# EAGLE design Autopilot (EAGLE 9.6.2)
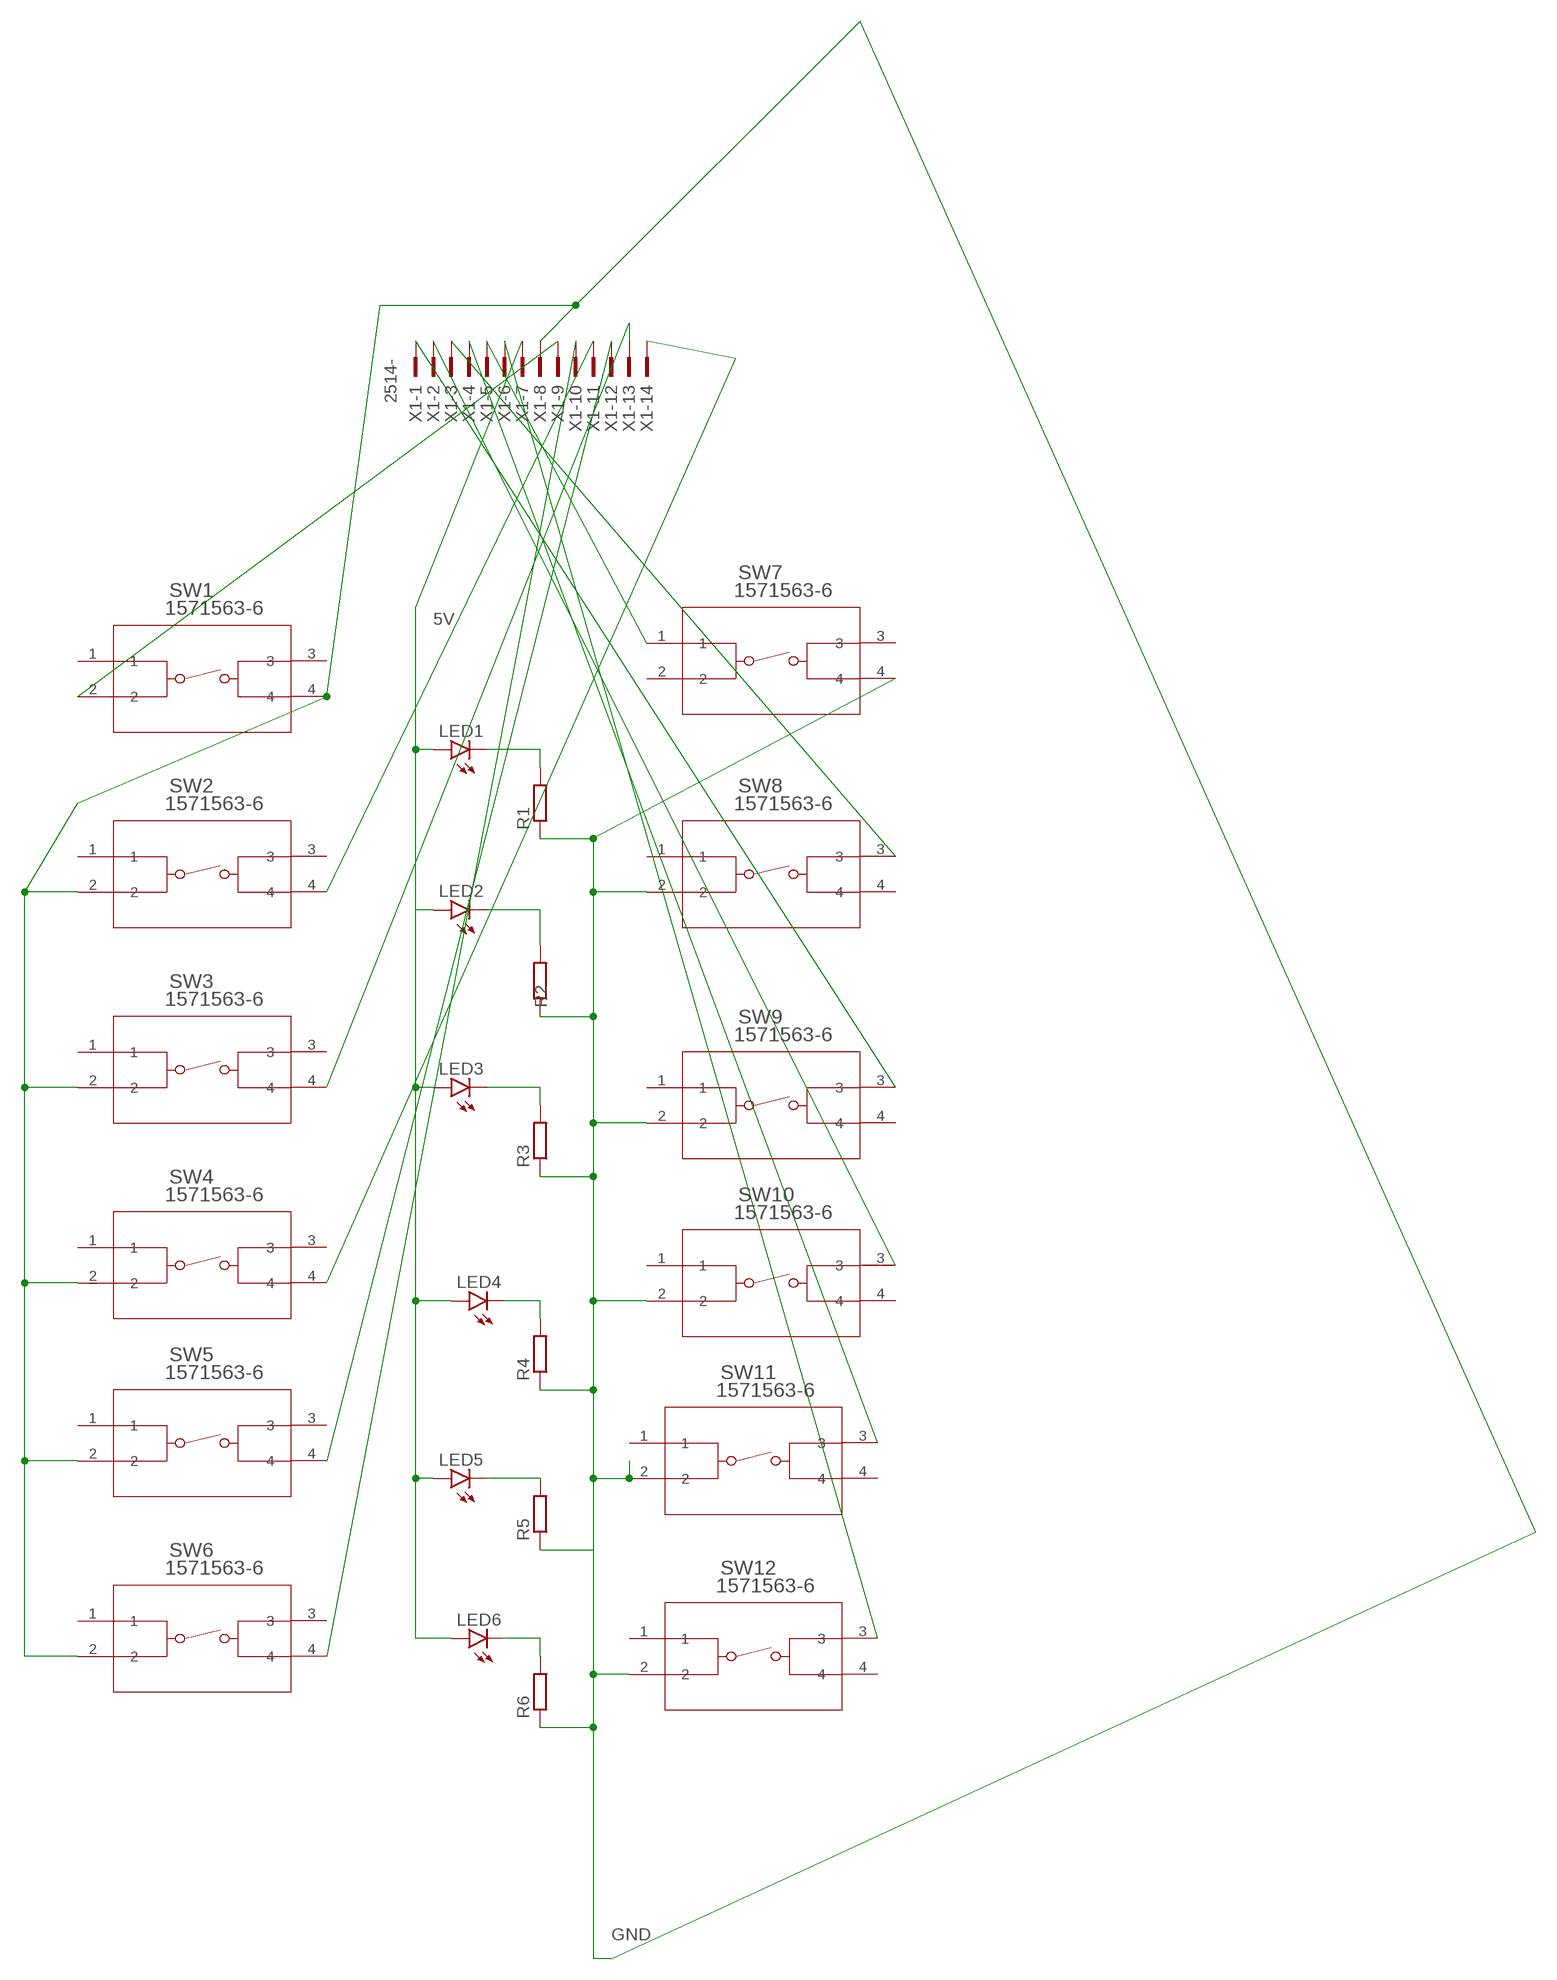
[diagram p0: schematic, sheet 1]

## Parts
LED1  LEDCHIPLED_1206  [CHIPLED_1206]
LED2  LEDCHIPLED_1206  [CHIPLED_1206]
LED3  LEDCHIPLED_1206  [CHIPLED_1206]
LED4  LEDCHIPLED_1206  [CHIPLED_1206]
LED5  LEDCHIPLED_1206  [CHIPLED_1206]
LED6  LEDCHIPLED_1206  [CHIPLED_1206]
R1  R-EU_R1206  [R1206]
R2  R-EU_R1206  [R1206]
R3  R-EU_R1206  [R1206]
R4  R-EU_R1206  [R1206]
R5  R-EU_R1206  [R1206]
R6  R-EU_R1206  [R1206]
SW1  1571563-6  [SW4_1437565-E]
SW2  1571563-6  [SW4_1437565-E]
SW3  1571563-6  [SW4_1437565-E]
SW4  1571563-6  [SW4_1437565-E]
SW5  1571563-6  [SW4_1437565-E]
SW6  1571563-6  [SW4_1437565-E]
SW7  1571563-6  [SW4_1437565-E]
SW8  1571563-6  [SW4_1437565-E]
SW9  1571563-6  [SW4_1437565-E]
SW10  1571563-6  [SW4_1437565-E]
SW11  1571563-6  [SW4_1437565-E]
SW12  1571563-6  [SW4_1437565-E]
X1  2514-  [PAK100/2500-14]

## Nets
5V: LED1.A LED2.A LED3.A LED4.A LED5.A LED6.A X1.7
GND: R1.1 R2.1 R3.1 R4.1 R5.1 R6.1 SW1.4 SW2.2 SW3.2 SW4.2 SW5.2 SW6.2 SW7.4 SW8.2 SW9.2 SW10.2 SW11.2 SW12.2 X1.8
N$1: LED1.C R1.2
N$2: LED2.C R2.2
N$3: LED3.C R3.2
N$4: LED4.C R4.2
N$5: LED5.C R5.2
N$6: LED6.C R6.2
N$7: SW1.2 X1.9
N$8: SW7.1 X1.5
N$9: SW8.3 X1.3
N$10: SW9.3 X1.1
N$11: SW10.3 X1.2
N$12: SW11.3 X1.4
N$13: SW12.3 X1.6
N$14: SW2.4 X1.11
N$15: SW4.4 X1.14
N$16: SW3.4 X1.13
N$17: SW5.4 X1.12
N$18: SW6.4 X1.10
Unconnected: SW1.1 SW1.3 SW2.1 SW2.3 SW3.1 SW3.3 SW4.1 SW4.3 SW5.1 SW5.3 SW6.1 SW6.3 SW7.2 SW7.3 SW8.1 SW8.4 SW9.1 SW9.4 SW10.1 SW10.4 SW11.1 SW11.4 SW12.1 SW12.4

## Library data of the parts
LED1-LED6 = led:LED: LED OSRAM: - CHIPLED LG R971, LG N971, LY N971, LG Q971, LY Q971, LO R971, LY R971 LH N974, LH R974 LS Q976, LO Q976, LY Q976 LO Q996 - Hyper CHIPLED LW Q18S LB Q993, LB Q99A, LB R99A - SideLED LS A670, LO A670, LY A670, LG A670, LP A670 LB A673, LV A673, LT A673, LW A673 LH A674 LY A675 LS A676, LA A676, LO A676, LY A676, LW A676 LS A679, LY A679, LG A679 - Hyper Micro SIDELED® LS Y876, LA Y876, LO Y876, LY Y876 LT Y87S - SmartLED LW L88C, LW L88S LB L89C, LB L89S, LG L890 LS L89K, LO L89K, LY L89K LS L896, LA L896, LO L896, LY L896 - TOPLED LS T670, LO T670, LY T670, LG T670, LP T670 LSG T670, LSP T670, LSY T670, LOP T670, LYG T670 LG T671, LOG T671, LSG T671 LB T673, LV T673, LT T673, LW T673 LH T674 LS T676, LA T676, LO T676, LY T676, LB T676, LH T676, LSB T676, LW T676 LB T67C, LV T67C, LT T67C, LS T67K, LO T67K, LY T67K, LW E67C LS E67B, LA E67B, LO E67B, LY E67B, LB E67C, LV E67C, LT E67C LW T67C LS T679, LY T679, LG T679 LS T770, LO T770, LY T770, LG T770, LP T770 LB T773, LV T773, LT T773, LW T773 LH T774 LS E675, LA E675, LY E675, LS T675 LS T776, LA T776, LO T776, LY T776, LB T776 LHGB T686 LT T68C, LB T68C - Hyper Mini TOPLED® LB M676 - Mini TOPLED Santana® LG M470 LS M47K, LO M47K, LY M47K Source: http://www.osram.convergy.de LUXEON: - LUMILED® LXK2-PW12-R00, LXK2-PW12-S00, LXK2-PW14-U00, LXK2-PW14-V00 LXK2-PM12-R00, LXK2-PM12-S00, LXK2-PM14-U00 LXK2-PE12-Q00, LXK2-PE12-R00, LXK2-PE12-S00, LXK2-PE14-T00, LXK2-PE14-U00 LXK2-PB12-K00, LXK2-PB12-L00, LXK2-PB12-M00, LXK2-PB14-N00, LXK2-PB14-P00, LXK2-PB14-Q00 LXK2-PR12-L00, LXK2-PR12-M00, LXK2-PR14-Q00, LXK2-PR14-R00 LXK2-PD12-Q00, LXK2-PD12-R00, LXK2-PD12-S00 LXK2-PH12-R00, LXK2-PH12-S00 LXK2-PL12-P00, LXK2-PL12-Q00, LXK2-PL12-R00 Source: www.luxeon.com KINGBRIGHT: KA-3528ASYC Source: www.kingbright.com
R1-R6 = rcl:R-EU_: RESISTOR, European symbol; SPICEPREFIX: R
SW1-SW12 = Switches:1571563-6; BUILT_BY: EMA_UL_Team; CATEGORY: Tactile Switches; COPYRIGHT: Copyright (C) 2016 Accelerated Designs. All rights reserved; DESCRIPTION: FSM14JSMAATR=TACT,SMT,T&R; MANUFACTURER_PART_NUMBER: 1571563-6; PART_STATUS: active; SERIES: Alcoswitch FSMJSMA; VENDOR: TE Connectivity
X1 = con-3m:2514-: 3M (TM) Pak 100 4-Wall Header Source: 3M; OC_FARNELL: unknown; OC_NEWARK: unknown

## Board
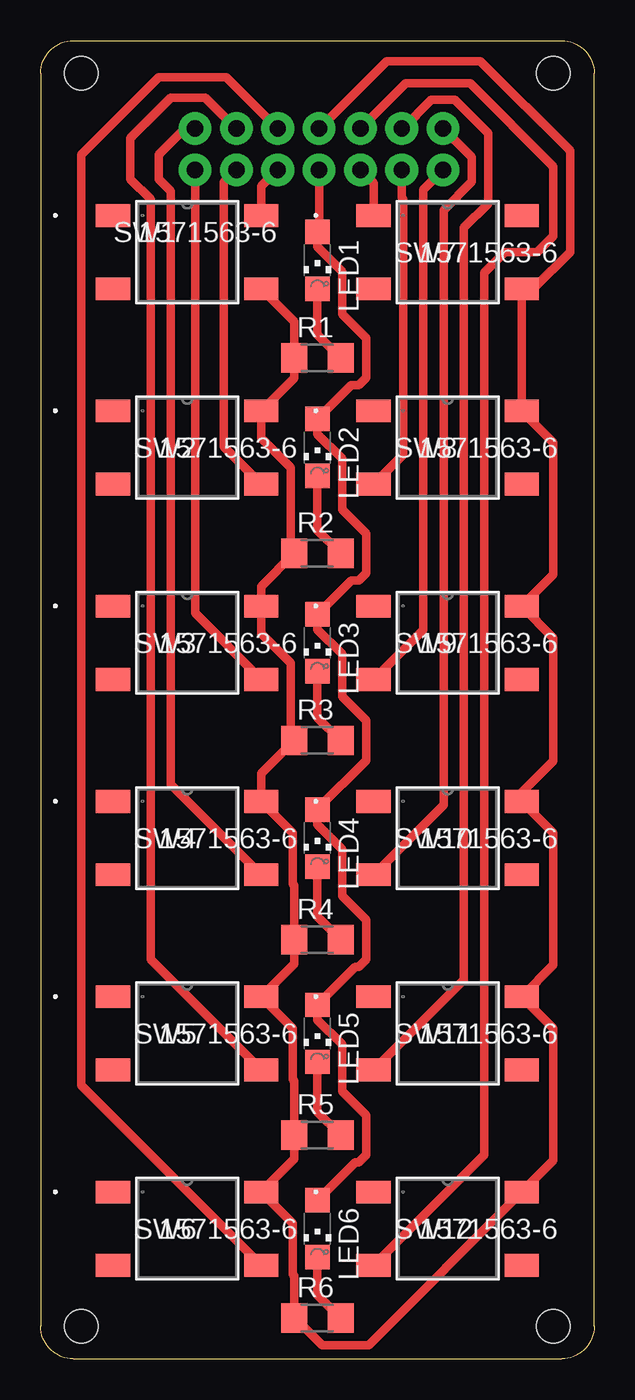
[diagram p1: board, top side]
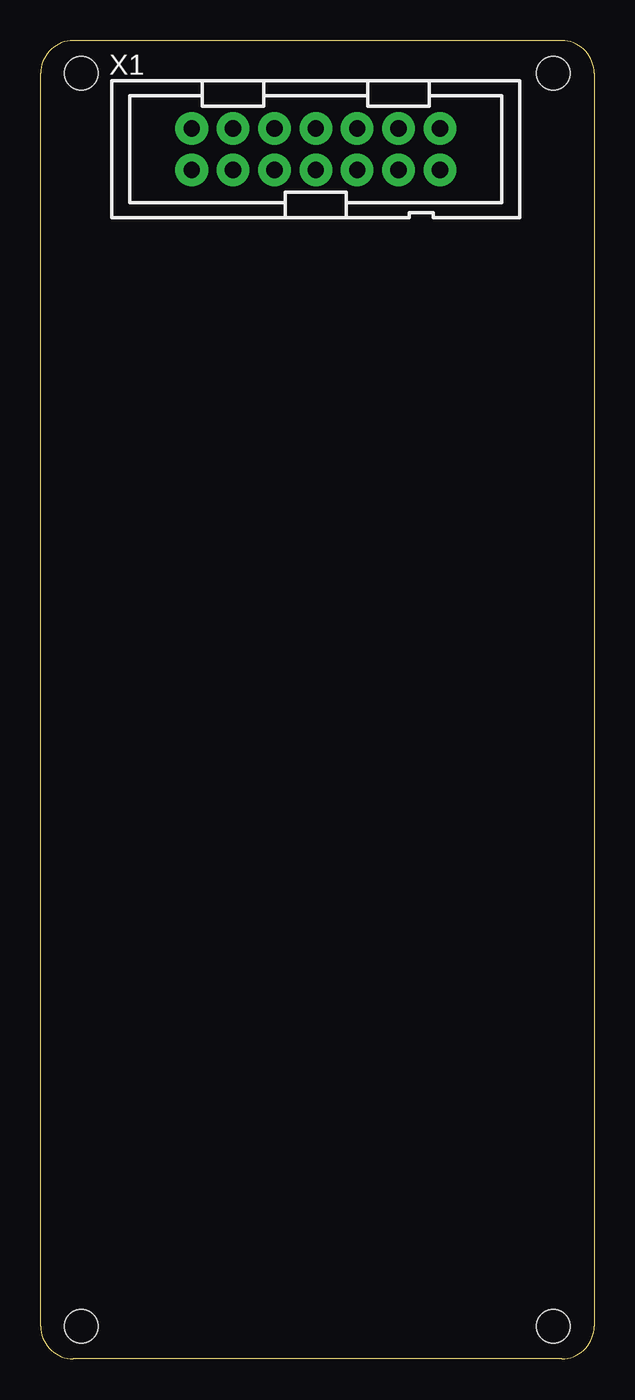
[diagram p2: board, bottom side, seen from below]

Size 34 x 81 mm. Coordinates in mm from the lower left corner, seen from the top.
Outline: 2,0 32,0 arc90 34,2 34,79 arc90 32,81 2,81 arc90 0,79 0,2 arc90 2,0
Copper layers (1*16): Top 0.035mm / dielectric 1.5mm / Bottom 0.035mm
Design rules "swidzi_milling_3018_tht_test": minimum track width 20mil, minimum drill 0.8mm, track to track 20mil, track to pad 20mil, pad to pad 20mil, via to via 6mil, smd to smd 6mil, copper to edge 15mil, drill to drill 6mil, minimum pad ring 10mil, minimum via ring 8mil, stop-mask expansion 4mil, vias tented up to drill 0mil, thermal gap 10mil
Holes 2.05 mm at 2.5,2 31.5,2 2.5,79 31.5,79

### Footprints (pad centres in the part's own frame; a part is rotated, then mirrored left to right if it is on the bottom)
CHIPLED_1206 = smd 1.5 x 1.5: A 0,-1.75; C 0,1.75
R1206 = smd 1.6 x 1.803: 1 -1.422,0; 2 1.422,0
SW4_1437565-E = smd 2.108 x 1.397: 1 -4.55,2.25; 2 4.55,2.25; 3 -4.55,-2.25; 4 4.55,-2.25
PAK100/2500-14 = drill 1 pad 1.422: 1 -7.62,-1.27; 2 -7.62,1.27; 3 -5.08,-1.27; 4 -5.08,1.27; 5 -2.54,-1.27; 6 -2.54,1.27; 7 0,-1.27; 8 0,1.27; 9 2.54,-1.27; 10 2.54,1.27; 11 5.08,-1.27; 12 5.08,1.27; 13 7.62,-1.27; 14 7.62,1.27

### Placement (x,y rotation side)
LED1  17,67.5 180 top
LED2  17,56 180 top
LED3  17,44 180 top
LED4  17,32 180 top
LED5  17,20 180 top
LED6  17,8 180 top
R1  17,61.5 0 top
R2  17,49.5 0 top
R3  17,38 0 top
R4  17,25.75 0 top
R5  17,13.75 0 top
R6  17,2.5 0 top
SW1  9,68 0 top
SW2  9,56 0 top
SW3  9,44 0 top
SW4  9,32 0 top
SW5  9,20 0 top
SW6  9,8 0 top
SW7  25,68 0 top
SW8  25,56 0 top
SW9  25,44 0 top
SW10  25,32 0 top
SW11  25,20 0 top
SW12  25,8 0 top
X1  17.1,74.33 0 bottom

### Tracks (layer width: path | path; a pad name or v marks a point on that pad's centre or on a via)
5V
  Top 0.508: X1.7 17.1,69.35 LED1.A 17,68.33 18.51,66.82 18.51,64.19 19.98,62.72 19.98,60.28 19.54,59.84 19.09,59.84 LED2.A 17,56.83 18.51,55.32 18.51,52.19 19.98,50.72 19.98,48.28 19.54,47.84 19.09,47.84 LED3.A 17,44.83 18.51,43.32 18.51,40.69 19.98,39.22 19.98,36.78 17,33.8 LED4.A 17,32.83 18.51,31.32 18.51,28.44 19.98,26.97 19.98,24.53 19.54,24.09 19.34,24.09 LED5.A 17,20.83 18.51,19.32 18.51,16.44 19.98,14.97 19.98,12.53 19.54,12.09 19.34,12.09 LED6.A
GND
  Top 0.508: SW1.4 15.58,63.72 R1.1 15.58,60.28 SW2.2 13.55,56.58 15.37,54.76 15.37,49.71 R2.1 13.55,47.47 SW3.2 13.55,44.58 15.37,42.76 15.37,38.21 R3.1 13.55,35.97 SW4.2 15.49,32.31 15.49,29.18 15.58,29.09 R4.1 15.58,24.28 SW5.2 15.49,20.31 15.49,17.18 15.58,17.09 R5.1 15.58,12.28 SW6.2 15.49,8.31 15.49,5.18 15.58,5.09 R6.1 15.64,2.5 17.31,0.84 20.14,0.84 SW12.2 31.5,12.2 31.5,20.3 SW11.2 31.5,24.2 31.5,32.3 SW10.2 29.55,34.8 31.5,36.75 31.5,44.3 SW9.2 31.5,48.2 31.5,56.3 SW8.2 SW7.4 30.25,65.75 32.52,68.02 32.52,74.23 27,79.75 21.25,79.75 X1.8
N$1
  Top 0.508: LED1.C 17,62.92 R1.2
N$2
  Top 0.508: LED2.C 17,50.92 R2.2
N$3
  Top 0.508: LED3.C 17,39.42 R3.2
N$4
  Top 0.508: LED4.C 17,27.17 R4.2
N$5
  Top 0.508: R5.2 17,15.17 LED5.C
N$6
  Top 0.508: LED6.C 17,3.92 R6.2
N$7
  Top 0.508: SW1.2 13.55,72.05 X1.9
N$8
  Top 0.508: SW7.1 20.45,72.25 X1.5
N$9
  Top 0.508: X1.3 22.18,71.35 22.27,71.26 22.27,55.57 SW8.3
N$10
  Top 0.508: SW9.3 23.5,44.8 23.5,71.84 X1.1
N$11
  Top 0.508: SW10.3 24.75,34.05 24.75,70.6 26.48,72.33 26.48,73.84 X1.2
N$12
  Top 0.508: X1.4 22.23,75.6 23.99,77.36 25.45,77.36 27.5,75.31 27.5,71 26,69.5 26,23.3 SW11.3
N$13
  Top 0.508: SW12.3 27.25,12.55 27.25,66.75 28.5,68 30.5,68 31.5,69 31.5,73.25 26.37,78.38 22.42,78.38 X1.6
N$14
  Top 0.508: SW2.4 11.25,56.05 11.25,72.29 X1.11
N$15
  Top 0.508: SW4.4 8,35.3 8,71.75 7.25,72.5 7.25,74 8.85,75.6 X1.14
N$16
  Top 0.508: X1.13 9.48,45.82 SW3.4
N$17
  Top 0.508: SW5.4 6.75,24.55 6.75,71.25 5.5,72.5 5.5,75 8,77.5 10.12,77.5 X1.12
N$18
  Top 0.508: SW6.4 2.5,16.8 2.5,74 7.25,78.75 11.41,78.75 X1.10